# EAGLE design sparklecon2014_badge_v2 (EAGLE 6.5.0)

## Sheet 1 of 2
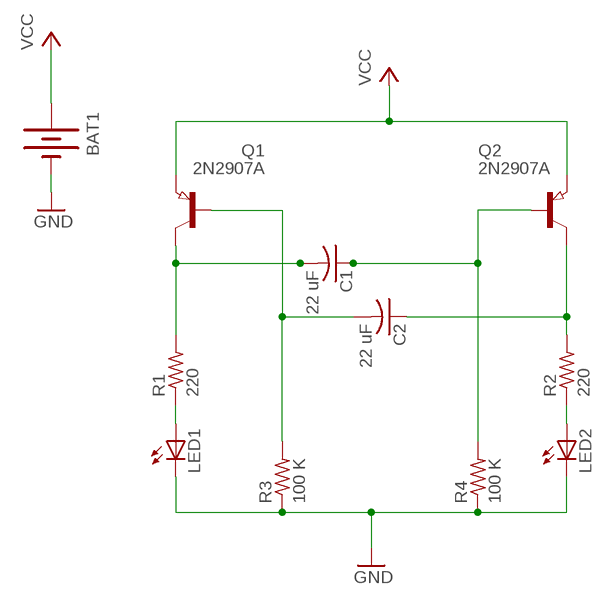
[diagram p0: schematic, sheet 1]

### Parts
BAT1  BATTERY20PTH  [BATTCOM_20MM_PTH]
C1  22 uF  C-USC1206K  [C1206K]
C2  22 uF  C-USC1206K  [C1206K]
LED1  LEDCHIPLED_1206  [CHIPLED_1206]
LED2  LEDCHIPLED_1206  [CHIPLED_1206]
Q1  2N2907A  PNP-TRANSISTOR_SOT23R  [SOT23]
Q2  2N2907A  PNP-TRANSISTOR_SOT23R  [SOT23]
R1  220  R-US_R0805  [R0805]
R2  220  R-US_R0805  [R0805]
R3  100 K  R-US_R0805  [R0805]
R4  100 K  R-US_R0805  [R0805]

### Nets
GND [ground]: BAT1.2(-) LED1.C LED2.C R3.1 R4.1 ; also sheet 2
N$1: C1.2 Q1.3(C) R1.2
N$2: C2.2 Q1.1(B) R3.2
N$3: LED2.A R2.1
N$8: LED1.A R1.1
N$20: C2.1 Q2.3(C) R2.2
N$23: C1.1 Q2.1(B) R4.2
VCC [power]: BAT1.1(+) Q1.2(E) Q2.2(E)

## Sheet 2 of 2
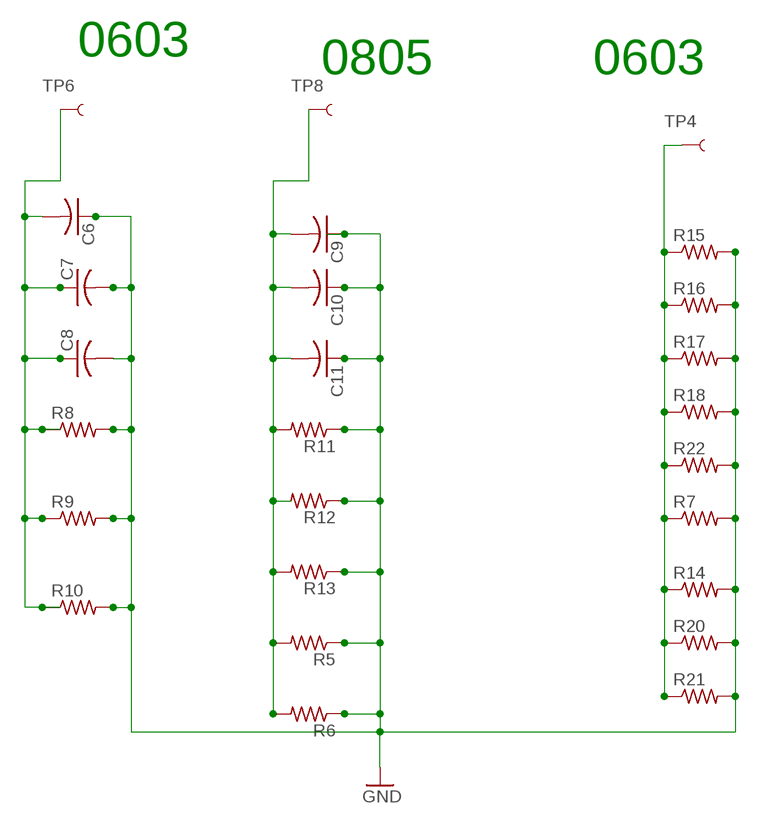
[diagram p1: schematic, sheet 2]

### Parts
C6  C-USC1206  [C1206]
C7  C-USC1206  [C1206]
C8  C-USC1206  [C1206]
C9  C-USC0805  [C0805]
C10  C-USC0805  [C0805]
C11  C-USC0805  [C0805]
R5  R-US_R0805  [R0805]
R6  R-US_R0805  [R0805]
R7  R-US_R0402  [R0402]
R8  R-US_R1206  [R1206]
R9  R-US_R1206  [R1206]
R10  R-US_R1206  [R1206]
R11  R-US_R0805  [R0805]
R12  R-US_R0805  [R0805]
R13  R-US_R0805  [R0805]
R14  R-US_R0402  [R0402]
R15  R-US_R0603  [R0603]
R16  R-US_R0603  [R0603]
R17  R-US_R0603  [R0603]
R18  R-US_R0603  [R0603]
R20  R-US_R0402  [R0402]
R21  R-US_R0402  [R0402]
R22  R-US_R0402  [R0402]
TP4  TEST-POINT3X5  [PAD.03X.05]
TP6  TEST-POINT3X5  [PAD.03X.05]
TP8  TEST-POINT3X5  [PAD.03X.05]

### Nets
GND [ground]: C6.1 C7.2 C8.2 C9.1 C10.1 C11.1 R5.1 R6.1 R7.2 R8.2 R9.2 R10.2 R11.1 R12.1 R13.1 R14.2 R15.2 R16.2 R17.2 R18.2 R20.2 R21.2 R22.2 ; also sheet 1
N$4: R7.1 R14.1 R15.1 R16.1 R17.1 R18.1 R20.1 R21.1 R22.1 TP4.P$1
N$6 [ground]: C6.2 C7.1 C8.1 R8.1 R9.1 R10.1 TP6.P$1
N$34 [ground]: C9.2 C10.2 C11.2 R5.2 R6.2 R11.2 R12.2 R13.2 TP8.P$1

### Notes on the sheet
- 0805
- 0603
- 0603

## Library data of the parts
BAT1 = SparkFun:BATTERY: Battery Holders Various common sizes : AA, AAA, 20mm coin cell and 12mm coin cell.
C1 C2 = resistor:C-US: CAPACITOR, American symbol
C6-C11 = rcl:C-US: CAPACITOR, American symbol
LED1 LED2 = led:LED: LED OSRAM: - CHIPLED LG R971, LG N971, LY N971, LG Q971, LY Q971, LO R971, LY R971 LH N974, LH R974 LS Q976, LO Q976, LY Q976 LO Q996 - Hyper CHIPLED LW Q18S LB Q993, LB Q99A, LB R99A - SideLED LS A670, LO A670, LY A670, LG A670, LP A670 LB A673, LV A673, LT A673, LW A673 LH A674 LY A675 LS A676, LA A676, LO A676, LY A676, LW A676 LS A679, LY A679, LG A679 - Hyper Micro SIDELED® LS Y876, LA Y876, LO Y876, LY Y876 LT Y87S - SmartLED LW L88C, LW L88S LB L89C, LB L89S, LG L890 LS L89K, LO L89K, LY L89K LS L896, LA L896, LO L896, LY L896 - TOPLED LS T670, LO T670, LY T670, LG T670, LP T670 LSG T670, LSP T670, LSY T670, LOP T670, LYG T670 LG T671, LOG T671, LSG T671 LB T673, LV T673, LT T673, LW T673 LH T674 LS T676, LA T676, LO T676, LY T676, LB T676, LH T676, LSB T676, LW T676 LB T67C, LV T67C, LT T67C, LS T67K, LO T67K, LY T67K, LW E67C LS E67B, LA E67B, LO E67B, LY E67B, LB E67C, LV E67C, LT E67C LW T67C LS T679, LY T679, LG T679 LS T770, LO T770, LY T770, LG T770, LP T770 LB T773, LV T773, LT T773, LW T773 LH T774 LS E675, LA E675, LY E675, LS T675 LS T776, LA T776, LO T776, LY T776, LB T776 LHGB T686 LT T68C, LB T68C - Hyper Mini TOPLED® LB M676 - Mini TOPLED Santana® LG M470 LS M47K, LO M47K, LY M47K Source: http://www.osram.convergy.de LUXEON: - LUMILED® LXK2-PW12-R00, LXK2-PW12-S00, LXK2-PW14-U00, LXK2-PW14-V00 LXK2-PM12-R00, LXK2-PM12-S00, LXK2-PM14-U00 LXK2-PE12-Q00, LXK2-PE12-R00, LXK2-PE12-S00, LXK2-PE14-T00, LXK2-PE14-U00 LXK2-PB12-K00, LXK2-PB12-L00, LXK2-PB12-M00, LXK2-PB14-N00, LXK2-PB14-P00, LXK2-PB14-Q00 LXK2-PR12-L00, LXK2-PR12-M00, LXK2-PR14-Q00, LXK2-PR14-R00 LXK2-PD12-Q00, LXK2-PD12-R00, LXK2-PD12-S00 LXK2-PH12-R00, LXK2-PH12-S00 LXK2-PL12-P00, LXK2-PL12-Q00, LXK2-PL12-R00 Source: www.luxeon.com KINGBRIGHT: KA-3528ASYC Source: www.kingbright.com
Q1 Q2 = 23B_Shop_Library:PNP-TRANSISTOR_: PNP TRANSISTOR
R1-R6 R8-R13 = rcl:R-US_: RESISTOR, American symbol
R7 R14-R18 R20-R22 = resistor:R-US_: RESISTOR, American symbol
TP4 TP6 TP8 = SparkFun:TEST-POINT

## Net classes
0 signals: width 0.305 mm, drill 0.457 mm, clearance 0.305 mm
1 ground: width 0.305 mm, drill 0.457 mm, clearance 0.305 mm
2 power: width 0.305 mm, drill 0.457 mm, clearance 0.305 mm

## Board
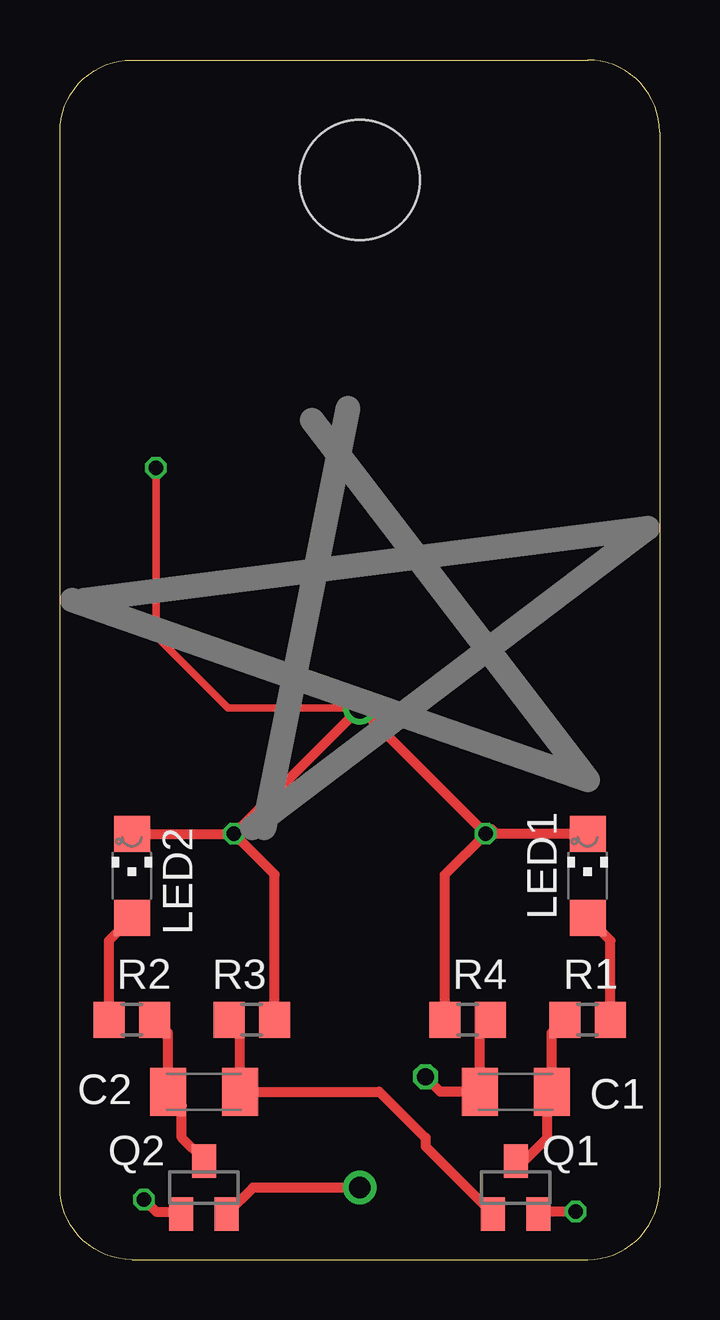
[diagram p2: board, top side]
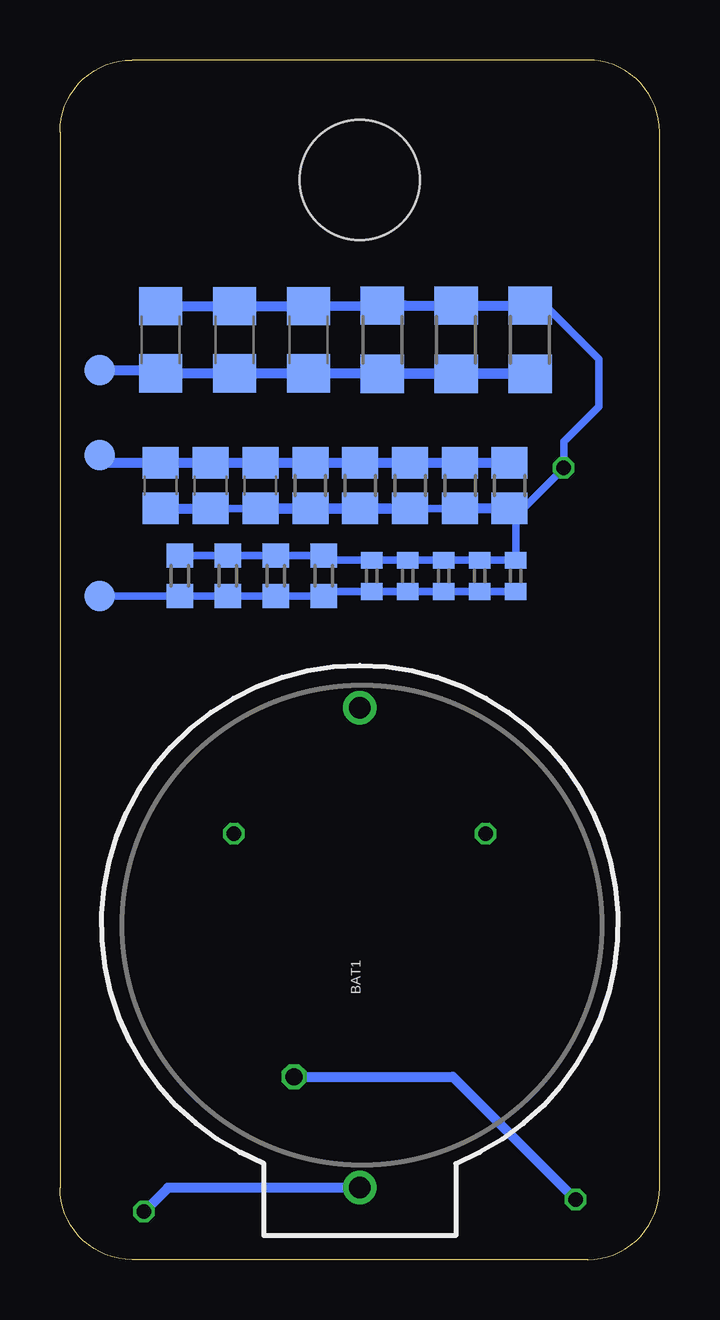
[diagram p3: board, bottom side, seen from below]

Size 25 x 50 mm. Coordinates in mm from the lower left corner, seen from the top.
Outline: 3,0 22,0 arc90 25,3 25,47 arc90 22,50 3,50 arc90 0,47 0,3 arc90 3,0
Copper layers (1*16): Top 0.035mm / dielectric 1.5mm / Bottom 0.035mm
Design rules "hackvana *": minimum track width 6mil, minimum drill 0.3mm, track to track 6mil, track to pad 6mil, pad to pad 6mil, via to via 6mil, smd to smd 0mil, copper to edge 6mil, drill to drill 6mil, minimum pad ring 10mil, minimum via ring 6mil, stop-mask expansion 0mil, vias tented up to drill 100mil, thermal gap 10mil
Holes 5 mm at 12.5,45

### Footprints (pad centres in the part's own frame; a part is rotated, then mirrored left to right if it is on the bottom)
BATTCOM_20MM_PTH = drill 0.889: 1 20,0; 2 0,0
C1206K = smd 1.5 x 2: 1 -1.5,0; 2 1.5,0
C1206 = smd 1.6 x 1.8: 1 -1.4,0; 2 1.4,0
C0805 = smd 1.3 x 1.5: 1 -0.95,0; 2 0.95,0
CHIPLED_1206 = smd 1.5 x 1.5: A 0,-1.75; C 0,1.75
SOT23 = smd 1 x 1.4: 1 -0.95,-1.1; 2 0.95,-1.1; 3 0,1.1
R0805 = smd 1.3 x 1.5: 1 -0.95,0; 2 0.95,0
R0402 = smd 0.7 x 0.9: 1 -0.65,0; 2 0.65,0
R1206 = smd 1.6 x 1.803: 1 -1.422,0; 2 1.422,0
R0603 = smd 1 x 1.1: 1 -0.85,0; 2 0.85,0
PAD.03X.05 = smd 1.27 x 1.27: P$1 0,0

### Placement (x,y rotation side)
BAT1  12.5,23 270 bottom
C1  19,7 0 top
C2  6,7 0 top
C6  20.8,38.34 270 bottom
C7  17.72,38.34 90 bottom
C8  14.64,38.34 90 bottom
C9  20.8,32.26 90 bottom
C10  18.72,32.26 90 bottom
C11  16.64,32.26 90 bottom
LED1  22,16 0 top
LED2  3,16 0 top
Q1  19,3 0 top
Q2  6,3 0 top
R1  22,10 180 top
R2  3,10 0 top
R3  8,10 180 top
R4  17,10 0 top
R5  6.26,32.26 90 bottom
R6  8.32,32.26 90 bottom
R7  12,28.5 90 bottom
R8  11.56,38.34 90 bottom
R9  8.48,38.34 90 bottom
R10  5.4,38.34 90 bottom
R11  14.56,32.26 90 bottom
R12  12.48,32.26 90 bottom
R13  10.4,32.26 90 bottom
R14  10.5,28.5 90 bottom
R15  20,28.5 90 bottom
R16  18,28.5 90 bottom
R17  16,28.5 90 bottom
R18  14,28.5 90 bottom
R20  9,28.5 90 bottom
R21  7.5,28.5 90 bottom
R22  6,28.5 90 bottom
TP4  23.34,27.66 180 bottom
TP6  23.34,37.07 90 bottom
TP8  23.34,33.53 90 bottom

### Tracks (layer width: path | path; a pad name or v marks a point on that pad's centre or on a via)
GND  (via drill 0.6)
  Top 0.305: LED1.C 18.25,17.75 18,18 | BAT1.2 7,23 4,26 v4,33
  Top 0.406: LED2.C v7.25,17.75 | v7.25,17.75 BAT1.2 v17.75,17.75 | LED1.C v17.75,17.75 | R4.1 16.05,16.05 v17.75,17.75 | R3.1 8.95,16.05 v7.25,17.75
  Bottom 0.305: C8.2 4.74,39.74 2.54,37.54 2.54,35.56 4,34.1 v4,33 6,31 | 6,31 6,31.05 R5.1 | C10.1 C11.1 | R13.1 R6.1 | 6,31 R22.2 R21.2 R20.2 R14.2 R7.2 14,29.15 R18.2 R17.2 R16.2 R15.2
  Bottom 0.406: R10.2 R9.2 R8.2 10.62,39.76 C8.2 C7.2 C6.1 | R12.1 R13.1 | R12.1 R11.1 C11.1 R12.1 | C9.1 C10.1 | 11.28,31.31 R12.1 | R5.1 R6.1
N$1
  Top 0.406: Q1.3 19.34,4.1 20.32,5.08 20.32,6.82 C1.2 20.5,9.45 R1.2
N$2
  Top 0.406: R3.2 7.5,9.55 C2.2 13.32,7 15.24,5.08 15.24,4.71 Q1.1
N$3
  Top 0.406: R2.1 2.05,13.3 LED2.A
N$4
  Bottom 0.305: R22.1 R21.1 R20.1 R14.1 R7.1 14,27.85 R18.1 R17.1 R16.1 R15.1 TP4.P$1
N$6
  Bottom 0.305: C6.2 20.87,36.94 21,37.07
  Bottom 0.406: R10.1 R9.1 R8.1 5.56,36.94 C8.1 C7.1 C6.2 | TP6.P$1 21,37.07 20.8,37.07
N$8
  Top 0.406: R1.1 22.95,13.3 LED1.A
N$20
  Top 0.406: R2.2 4.5,9.45 C2.1 5.08,6.42 5.08,5.08 6,4.16 Q2.3
N$23  (via drill 0.6, 0.7)
  Top 0.406: R4.2 17.5,9.55 C1.1 15.86,7 v15.24,7.62 | v3.5,2.5 4,2 4.95,2 Q2.1
  Bottom 0.406: v15.24,7.62 8.62,7.62 v3.5,2.5
N$34
  Bottom 0.406: TP8.P$1 23.02,33.21 C9.2 C10.2 C11.2 R11.2 R12.2 R13.2 R6.2 R5.2
VCC  (via drill 0.6)
  Top 0.406: v21.5,2 20.05,2 Q1.2 | BAT1.1 8.05,3 Q2.2
  Bottom 0.406: BAT1.1 20.5,3 v21.5,2

### Text on the board
_tsilk: SPARKLECON | 2.0
_bsilk: 1206 | 0805 | 0603 | 0402 | Board By: Arclight | www.sparklecon.org
200bmp: /home/arclight/start_1.bmp